# EAGLE design boost_converter (EAGLE 9.6.2)
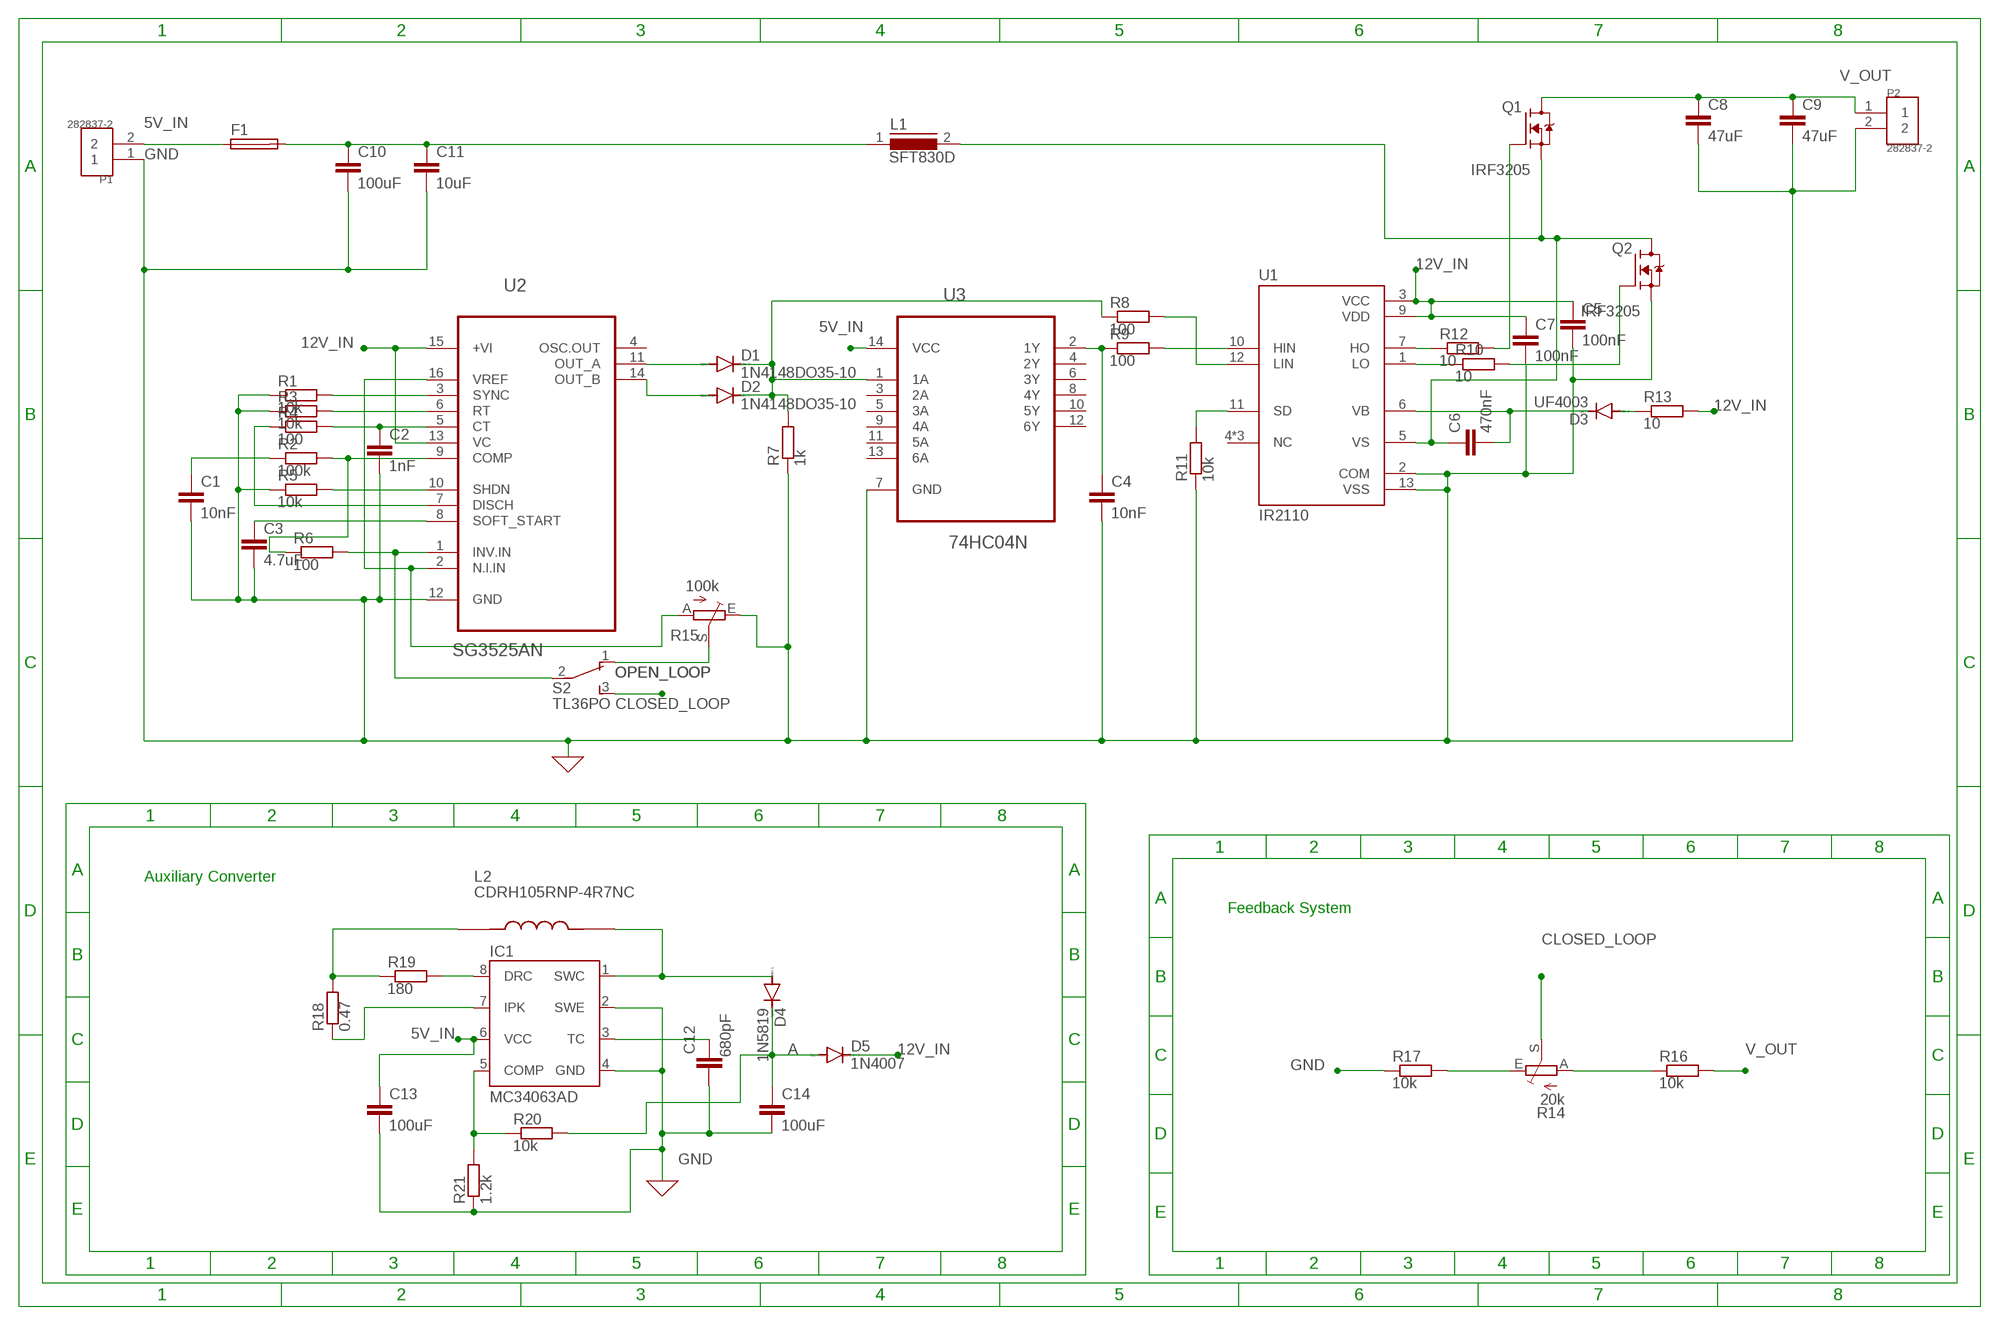
[diagram p0: schematic, sheet 1]

## Parts
C1  10nF  C2,5-3  [C2.5-3]
C2  1nF  C2,5-3  [C2.5-3]
C3  4.7uF  C2.5/5  [C2.5-5]
C4  10nF  C2,5-3  [C2.5-3]
C5  100nF  C2,5-3  [C2.5-3]
C6  470nF  C2,5-3  [C2.5-3]
C7  100nF  C2,5-3  [C2.5-3]
C8  47uF  C2.5/5  [C2.5-5]
C9  47uF  C2.5/5  [C2.5-5]
C10  100uF  C2.5/5  [C2.5-5]
C11  10uF  C2.5/5  [C2.5-5]
C12  680pF  C2,5-3  [C2.5-3]
C13  100uF  C2.5/5  [C2.5-5]
C14  100uF  C2.5/5  [C2.5-5]
D1  1N4148DO35-10  [DO35-10]
D2  1N4148DO35-10  [DO35-10]
D3  UF4003  [DO41-10]
D4  1N5819  1N4933  [DO41-10]
D5  1N4007  1N4004  [DO41-10]
F1  GSH15  [GSH15]
IC1  MC34063AD  [SO08]
L1  SFT830D  [SFT830D]
L2  CDRH105RNP-4R7NC  [IND_CDRH105RNP-4R7NC]
P1  282837-2  [TE_282837-2]
P2  282837-2  [TE_282837-2]
Q1  IRF3205  [TO254P1041X444X2933-3]
Q2  IRF3205  [TO254P1041X444X2933-3]
R1  10k  R-EU_0207/10  [0207/10]
R2  100k  R-EU_0207/10  [0207/10]
R3  10k  R-EU_0207/10  [0207/10]
R4  100  R-EU_0207/10  [0207/10]
R5  10k  R-EU_0207/10  [0207/10]
R6  100  R-EU_0207/10  [0207/10]
R7  1k  R-EU_0207/10  [0207/10]
R8  100  R-EU_0207/10  [0207/10]
R9  100  R-EU_0207/10  [0207/10]
R10  10  R-EU_0207/10  [0207/10]
R11  10k  R-EU_0207/10  [0207/10]
R12  10  R-EU_0207/10  [0207/10]
R13  10  R-EU_0207/10  [0207/10]
R14  20k  TRIM_EU-S64W  [S64W]
R15  100k  TRIM_EU-S64W  [S64W]
R16  10k  R-EU_0309/10  [0309/10]
R17  10k  R-EU_0309/10  [0309/10]
R18  0.47  R-EU_0207/10  [0207/10]
R19  180  R-EU_0207/10  [0207/10]
R20  10k  R-EU_0207/10  [0207/10]
R21  1.2k  R-EU_0207/10  [0207/10]
S2  TL36PO  [TL3XPO]
U1  IR2110  [DIP762W45P254L2019H533Q14]
U2  SG3525AN  [DIP254P762X510-16]
U3  74HC04N  [DIP254P762X420-14]

## Nets
5V_IN: C10.1 C11.1 C13.1 F1.1 F1.2 IC1.6(VCC) L1.1 P1.2 U3.14(VCC)
12V_IN: C5.1 C7.1 D5.C R13.2 U1.3(VCC) U1.9(VDD) U2.13(VC) U2.15(+VI)
A: C14.1 D4.C D5.A R20.2
CLOSED_LOOP: R14.S S2.3(S)
GND: C1.2 C2.2 C3.2 C4.2 C5.2 C7.2 C8.2 C9.2 C10.2 C11.2 C12.1 C13.2 C14.2 IC1.2(SWE) IC1.4(GND) P1.1 P2.2 Q2.3(S) R1.1 R3.1 R5.1 R7.1 R11.1 R15.E R17.1 R21.1 U1.2(COM) U1.13(VSS) U2.12(GND) U3.7(GND)
N$1: R15.A U2.2(N.I.IN) U2.16(VREF)
N$2: R2.2 R6.1 U2.9(COMP)
N$3: C1.1 R2.1
N$4: R3.2 U2.6(RT)
N$5: R1.2 U2.3(SYNC)
N$6: C2.1 R4.2 U2.5(CT)
N$7: R4.1 U2.7(DISCH)
N$8: D3.A R13.1
N$9: R5.2 U2.10(SHDN)
N$10: C3.1 U2.8(SOFT_START)
N$11: R6.2 S2.2(P) U2.1(INV.IN)
N$12: D2.A U2.14(OUT_B)
N$13: D1.A U2.11(OUT_A)
N$14: D1.C D2.C R7.2 R8.1 U3.1(1A)
N$15: R8.2 U1.12(LIN)
N$16: C4.1 R9.1 U3.2(1Y)
N$17: R9.2 U1.10(HIN)
N$18: R10.1 U1.1(LO)
N$19: IC1.8(DRC) R19.2
N$20: L2.1 R18.2 R19.1
N$21: C6.1 L1.2 Q1.3(S) Q2.2(D) U1.5(VS)
N$22: C6.2 D3.C U1.6(VB)
N$23: R11.2 U1.11(SD)
N$24: R12.1 U1.7(HO)
N$25: Q2.1(G) R10.2
N$26: Q1.1(G) R12.2
N$27: R14.A R16.1
N$28: R14.E R17.2
N$29: IC1.7(IPK) R18.1
N$30: IC1.5(COMP) R20.1 R21.2
N$34: C12.2 IC1.3(TC)
N$37: D4.A IC1.1(SWC) L2.2
OPEN_LOOP: R15.S S2.1(O)
V_OUT: C8.1 C9.1 P2.1 Q1.2(D) R16.2
Unconnected: U1.4(NC) U1.8(NC) U1.14(NC) U2.4(OSC.OUT) U3.3(2A) U3.4(2Y) U3.5(3A) U3.6(3Y) U3.8(4Y) U3.9(4A) U3.10(5Y) U3.11(5A) U3.12(6Y) U3.13(6A)

## Notes on the sheet
- Auxiliary Converter
- Feedback System

## Library data of the parts
C1-C14 = capacitor-wima:C: CAPACITOR naming: grid - package width
D1 D2 = diode:1N4148: DIODE high speed (Philips)
D3 = diode:UF4003: DIODE ultrafast recovery diode, 200 V rectifier
D4 = diode:1N4933: DIODE fast recovery rectifier, 1A
D5 = diode:1N4004: DIODE general purpose rectifier, 1 A
F1 = fuse:GSH15: FUSE HOLDER grid 15mm, 19649 Wickmann; MPN: 64900001039; OC_FARNELL: 1271673; OC_NEWARK: 02P0318
IC1 = MC34063A:MC34063A: Check availability <https://pricing.snapeda.com/parts/MC34063A/Texas%20Instruments/view-part?ref=eda>; AVAILABILITY: Not in stock; CHECK_PRICES: https://www.snapeda.com/parts/MC34063A/Texas+Instruments/view-part/?ref=eda; DESCRIPTION: Buck, Boost Switching Regulator IC Positive or Negative Adjustable 1.25V 1 Output 1.5A (Switch) 8-SOIC (0.154, 3.90mm Width); MF: Texas Instruments; MP: MC34063A; PACKAGE: SOIC-8 Texas Instruments; PRICE: None; SNAPEDA_LINK: https://www.snapeda.com/parts/MC34063A/Texas+Instruments/view-part/?ref=snap
L1 = inductors:SFT830D: INDUCTOR; SPICEPREFIX: L
L2 = CDRH105RNP-4R7NC:CDRH105RNP-4R7NC: Check availability <https://pricing.snapeda.com/parts/CDRH105RNP-4R7NC/Sumida/view-part?ref=eda>; AVAILABILITY: In Stock; CHECK_PRICES: https://www.snapeda.com/parts/CDRH105RNP-4R7NC/Sumida/view-part/?ref=eda; DESCRIPTION: 4.7 µH Shielded - Inductor 6.1 A 12.3mOhm Max Nonstandard; MF: Sumida; MP: CDRH105RNP-4R7NC; PACKAGE: Nonstandard Sumida; PRICE: None; SNAPEDA_LINK: https://www.snapeda.com/parts/CDRH105RNP-4R7NC/Sumida/view-part/?ref=snap
P1 P2 = 282837-2:282837-2: Check availability <https://pricing.snapeda.com/parts/282837-2/TE%20Connectivity/view-part?ref=eda>; AVAILABILITY: In Stock; CHECK_PRICES: https://www.snapeda.com/parts/282837-2/TE+Connectivity+AMP+Connectors/view-part/?ref=eda; COMMENT: 282837-2; DESCRIPTION: Terminal Block Connector Wire Receptacle 2 5.08 mm 30-16 AWG Green 13.5 A 250 V | TE Connectivity 282837-2; MF: TE Connectivity; MP: 282837-2; PACKAGE: None; PRICE: None; SNAPEDA_LINK: https://www.snapeda.com/parts/282837-2/TE+Connectivity+AMP+Connectors/view-part/?ref=snap
Q1 Q2 = IRF3205:IRF3205: Check availability <https://pricing.snapeda.com/parts/IRF3205/Infineon%20Technologies/view-part?ref=eda>; AVAILABILITY: In Stock; CHECK_PRICES: https://www.snapeda.com/parts/IRF3205/Infineon/view-part/?ref=eda; DESCRIPTION: N-Channel 55V 110A (Tc) 200W (Tc) Through Hole TO-220AB; MF: Infineon Technologies; MP: IRF3205; PACKAGE: TO-220 Infineon; PRICE: None; SNAPEDA_LINK: https://www.snapeda.com/parts/IRF3205/Infineon/view-part/?ref=snap
R1-R13 R16-R21 = rcl:R-EU_: RESISTOR, European symbol; SPICEPREFIX: R
R14 R15 = pot:TRIM_EU-: POTENTIOMETER
S2 = switch:TL36PO: TINY SWITCH ON - ON Source: http://www2.produktinfo.conrad.com/datenblaetter/700000-724999/705152-da-01-de-Subminiaturschalter_TL_36YO.pdf
U1 = IR2110:IR2110: Check availability <https://pricing.snapeda.com/parts/IR2110/Infineon/view-part?ref=eda>; AVAILABILITY: In Stock; CHECK_PRICES: https://www.snapeda.com/parts/IR2110/Infineon/view-part/?ref=eda; DESCRIPTION: Half-Bridge Gate Driver IC Non-Inverting 14-PDIP; MF: Infineon; MP: IR2110; PACKAGE: DIP-14 International Rectifier; PRICE: None; SNAPEDA_LINK: https://www.snapeda.com/parts/IR2110/Infineon/view-part/?ref=snap
U2 = SG3525AN:SG3525AN: Check availability <https://pricing.snapeda.com/parts/SG3525AN/STMicroelectronics/view-part?ref=eda>; AVAILABILITY: In Stock; CHECK_PRICES: https://www.snapeda.com/parts/SG3525AN/STMicroelectronics/view-part/?ref=eda; DESCRIPTION: Buck, Push-Pull Regulator Positive Output Step-Down, Step-Up/Step-Down - DC-DC Controller IC 16-DIP; MF: STMicroelectronics; MP: SG3525AN; PACKAGE: PDIP-16 ON Semiconductor; PRICE: None; SNAPEDA_LINK: https://www.snapeda.com/parts/SG3525AN/STMicroelectronics/view-part/?ref=snap
U3 = 74HC04N:74HC04N: Check availability <https://pricing.snapeda.com/parts/74HC04N/Texas%20Instruments/view-part?ref=eda>; AVAILABILITY: In Stock; CHECK_PRICES: https://www.snapeda.com/parts/74HC04N/Texas+Instruments/view-part/?ref=eda; DESCRIPTION: Inverter IC 6 Channel - 14-PDIP; MF: Texas Instruments; MP: 74HC04N; PACKAGE: DIP-14 NXP Semiconductors; PRICE: None; SNAPEDA_LINK: https://www.snapeda.com/parts/74HC04N/Texas+Instruments/view-part/?ref=snap

## Board
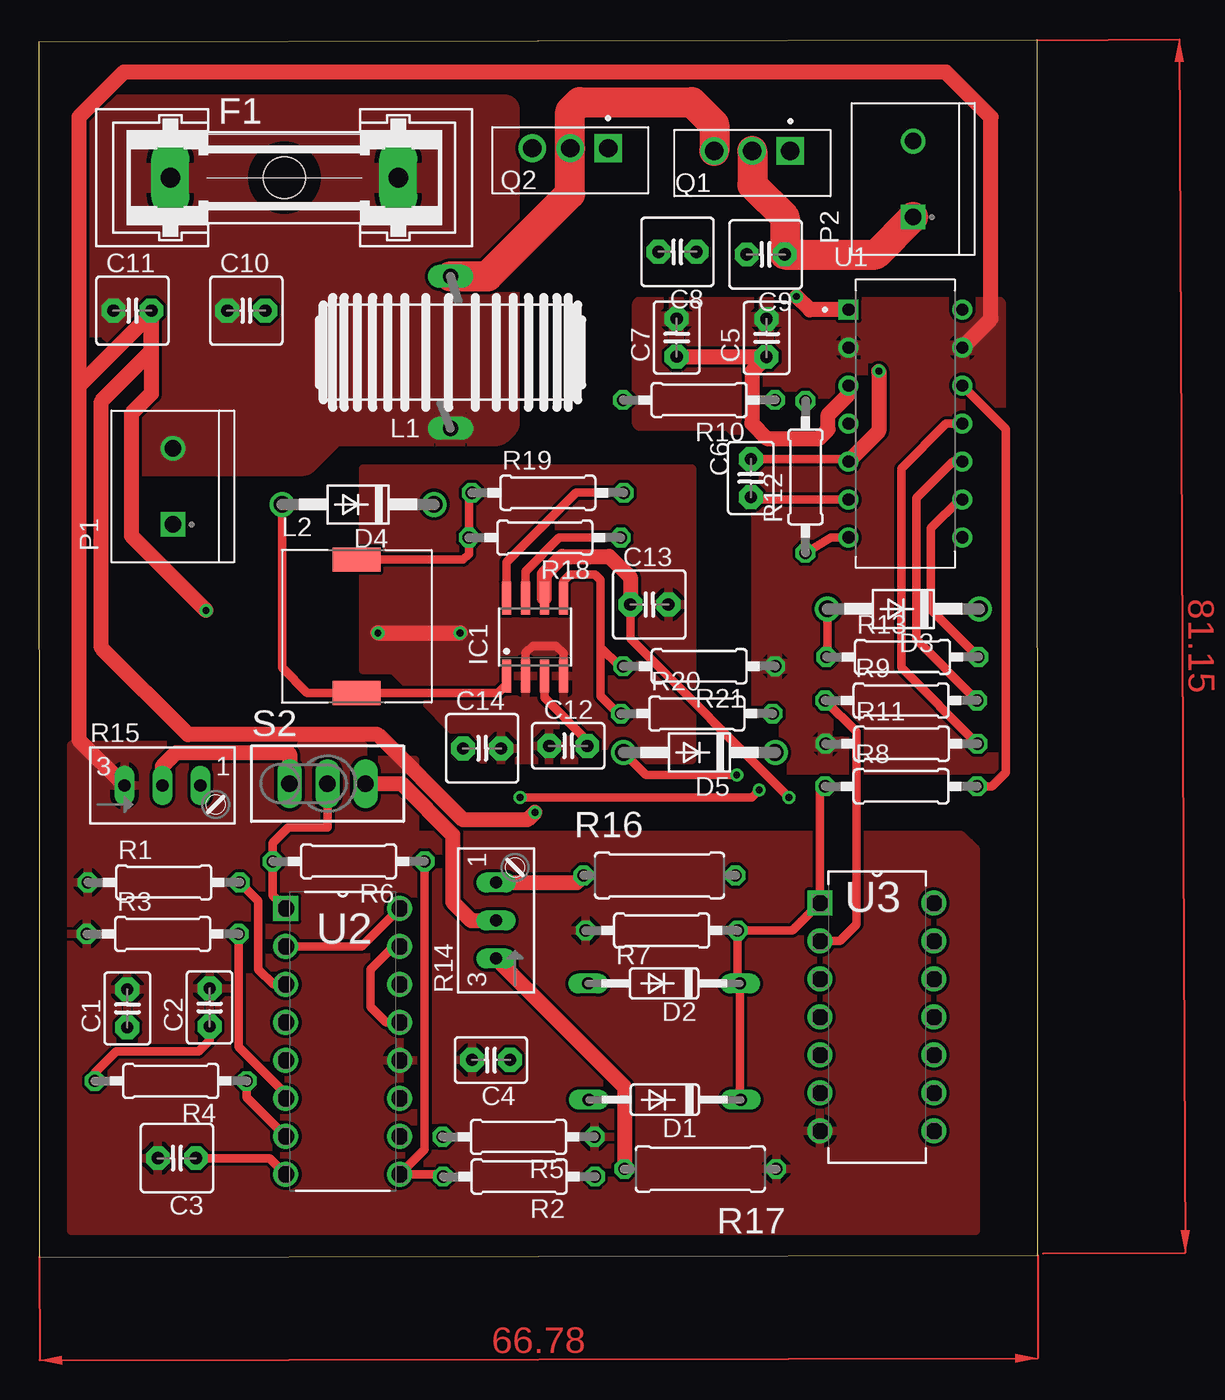
[diagram p1: board, top side]
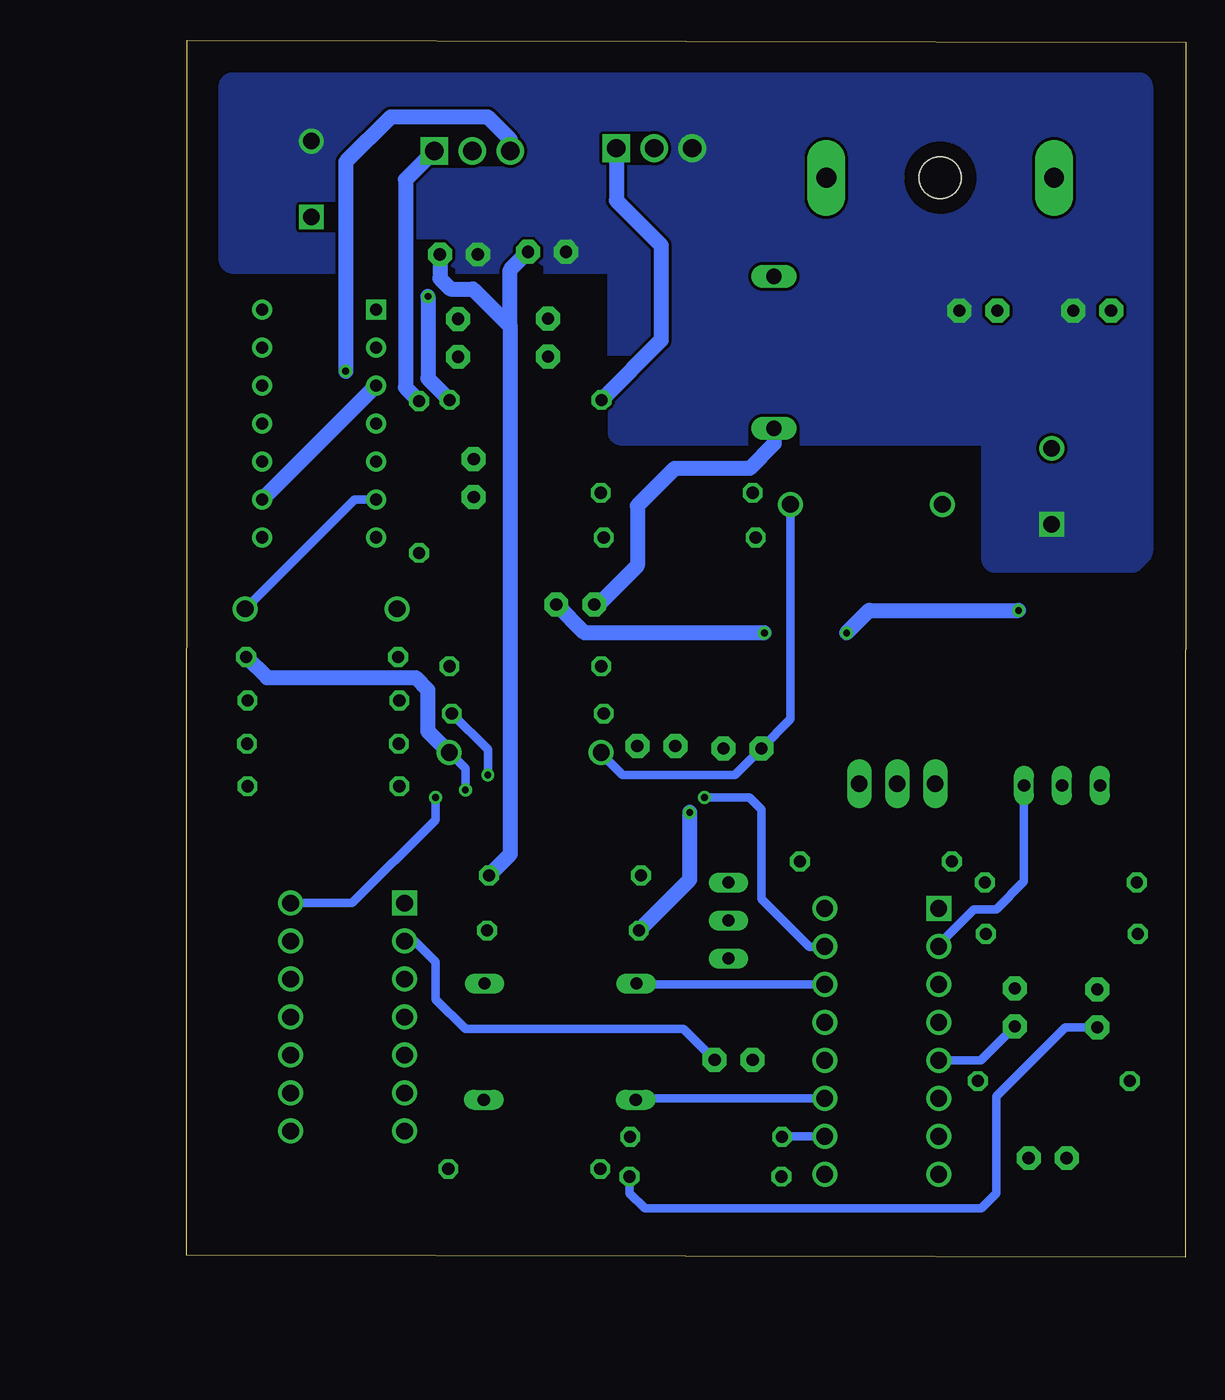
[diagram p2: board, bottom side, seen from below]

Size 66.8 x 81.41 mm. Coordinates in mm from the lower left corner, seen from the top.
Outline: 0.03,0 66.8,0.14 66.78,81.41 0,81.27 0.03,0
Copper layers (1*16): Top 0.035mm / dielectric 1.5mm / Bottom 0.035mm
Design rules "default": minimum track width 22mil, minimum drill 18mil, track to track 8mil, track to pad 8mil, pad to pad 8mil, via to via 8mil, smd to smd 8mil, copper to edge 40mil, drill to drill 8mil, minimum pad ring 10mil, minimum via ring 8mil, stop-mask expansion 4mil, vias tented up to drill 0mil, thermal gap 12mil

### Footprints (pad centres in the part's own frame; a part is rotated, then mirrored left to right if it is on the bottom)
C2.5-3 = drill 0.813 pad 1.6 octagon: 1 -1.27,0; 2 1.27,0
C2.5-5 = drill 0.813 pad 1.6 octagon: 1 -1.27,0; 2 1.27,0
DO35-10 = drill 0.813 long: A 5.08,0; C -5.08,0
DO41-10 = drill 1.118: A 5.08,0; C -5.08,0
GSH15 = drill 1.321 pad 2.54 long: 1 -7.62,0; 2 7.62,0 | hole 2.794: 0,0
SO08 = smd 0.6 x 2.2: 1 -1.905,-2.6; 2 -0.635,-2.6; 3 0.635,-2.6; 4 1.905,-2.6; 5 1.905,2.6; 6 0.635,2.6; 7 -0.635,2.6; 8 -1.905,2.6
SFT830D = drill 1.016 long: 1 -5.08,0; 2 5.08,0
IND_CDRH105RNP-4R7NC = smd 3.2 x 1.6: 1 0,4.45; 2 0,-4.45
TE_282837-2 = drill 1.1 square: 1 -2.54,0 | drill 1.1: 2 2.54,0
TO254P1041X444X2933-3 = drill 1.23 pad 1.85 square: 1 0,0 | drill 1.23 pad 1.85: 2 2.54,0; 3 5.08,0
0207/10 = drill 0.813 octagon: 1 -5.08,0; 2 5.08,0
S64W = drill 0.813 long: A 2.54,1.27; E -2.54,1.27; S 0,1.27
0309/10 = drill 0.813 octagon: 1 -5.08,0; 2 5.08,0
TL3XPO = drill 1.1 pad 1.422 long: 1 -2.54,0; 2 0,0; 3 2.54,0
DIP762W45P254L2019H533Q14 = drill 0.83 pad 1.25 square: 1 -3.81,7.62 | drill 0.83 pad 1.25: 2 -3.81,5.08; 3 -3.81,2.54; 4 -3.81,0; 5 -3.81,-2.54; 6 -3.81,-5.08; 7 -3.81,-7.62; 8 3.81,-7.62; 9 3.81,-5.08; 10 3.81,-2.54; 11 3.81,0; 12 3.81,2.54; 13 3.81,5.08; 14 3.81,7.62
DIP254P762X510-16 = drill 1.118 square: 1 -7.62,17.78 | drill 1.118: 2 -7.62,15.24; 3 -7.62,12.7; 4 -7.62,10.16; 5 -7.62,7.62; 6 -7.62,5.08; 7 -7.62,2.54; 8 -7.62,0; 9 0,0; 10 0,2.54; 11 0,5.08; 12 0,7.62; 13 0,10.16; 14 0,12.7; 15 0,15.24; 16 0,17.78
DIP254P762X420-14 = drill 1.118 square: 1 -7.62,15.24 | drill 1.118: 2 -7.62,12.7; 3 -7.62,10.16; 4 -7.62,7.62; 5 -7.62,5.08; 6 -7.62,2.54; 7 -7.62,0; 8 0,0; 9 0,2.54; 10 0,5.08; 11 0,7.62; 12 0,10.16; 13 0,12.7; 14 0,15.24

### Placement (x,y rotation side)
C1  5.91,16.64 90 top
C2  11.41,16.71 90 top
C3  9.23,6.63 180 top
C4  30.23,13.19 180 top
C5  48.67,61.49 90 top
C6  47.61,52.12 270 top
C7  42.66,61.51 90 top
C8  42.7,67.24 180 top
C9  48.61,67.07 180 top
C10  13.87,63.31 0 top
C11  6.25,63.31 0 top
C12  35.4,34.2 0 top
C13  40.82,43.65 0 top
C14  29.65,34.04 0 top
D1  41.86,10.54 180 top
D2  41.82,18.32 180 top
D3  57.82,43.37 180 top
D4  21.35,50.36 180 top
D5  44.17,33.76 180 top
F1  16.41,72.2 0 top
IC1  33.17,41.49 0 top
L1  27.53,60.52 90 top
L2  21.25,42.2 0 top
P1  8.95,51.55 90 top
P2  58.47,72.11 90 top
Q1  50.25,73.99 180 top
Q2  38.07,74.17 180 top
R1  8.35,25.07 0 top
R2  32.11,5.39 180 top
R3  8.28,21.62 0 top
R4  8.82,11.79 180 top
R5  32.07,8.06 180 top
R6  20.71,26.48 180 top
R7  41.65,21.85 0 top
R8  57.67,31.5 0 top
R9  57.67,37.24 0 top
R10  44.15,57.34 180 top
R11  57.7,34.35 0 top
R12  51.27,52.19 90 top
R13  57.76,40.15 0 top
R14  31.85,22.52 90 top
R15  8.26,30.29 0 top
R16  41.51,25.54 0 top
R17  44.23,5.91 180 top
R18  33.84,48.13 180 top
R19  34.04,51.13 0 top
R20  44,36.36 0 top
R21  44.16,39.53 180 top
S2  19.29,31.68 0 top
U1  57.95,55.76 0 top
U2  24.13,5.55 0 top
U3  59.87,8.45 0 top

### Tracks (layer width: path | path; a pad name or v marks a point on that pad's centre or on a via)
5V_IN  (via drill 0.46)
  Top 0.559: C13.1 39.55,41.38 v50.17,30.76
  Top 1: IC1.6 33.81,45.69 34.99,46.88 38.15,46.88 39.55,45.48 C13.1
  Bottom 0.559: v50.17,30.76 50.17,29.26 55.75,23.69 U3.14
  Bottom 1: L1.1 27.53,54.4 29.17,52.76 34.17,52.76 36.67,50.26 36.67,46.26 39.28,43.65 C13.1
  pour Top: 3.67,76.76 3.67,53.26 17.67,53.26 19.67,55.26 30.67,55.26 31.17,55.76 31.17,76.76
12V_IN  (via drill 0.46)
  Top 0.559: U2.15 24.11,20.76 23.67,20.76 22.17,19.26 22.17,16.76 23.23,15.71 U2.13 | R13.2 59.67,43.32 59.67,48.76 61.59,50.68 U1.9 | v48.17,31.26 47.67,30.76 v32.17,30.76
  Top 1: C7.1 48.64,60.24 C5.1 47.67,59.22 47.67,55.76 48.67,54.76 52.17,54.76 52.77,55.36 52.77,56.33 54.14,57.7 U1.3
  Bottom 0.559: U2.15 24.16,20.76 25.17,20.76 28.38,23.96 28.38,29.96 29.17,30.76 v32.17,30.76 | D5.C 48.17,32.68 v48.17,31.26
  Bottom 1: R13.2 61.44,38.76 51.48,38.76 | U1.3 U1.9
  Bottom 1.016: 51.48,38.76 50.67,37.95 50.67,35.18 D5.C
A  (via drill 0.46)
  Top 0.559: D5.A 40.59,32.26 v46.67,32.26
  Bottom 0.559: D4.C 26.43,35.99 C14.1 30.15,32.26 37.67,32.26 39.09,33.68 D5.A | v46.67,32.26 46.67,33.95 R20.2
CLOSED_LOOP
  Top 1: S2.3 24.26,31.68 27.67,28.26 27.67,23.76 28.91,22.52 R14.S
GND  (via drill 0.46)
  Top 0.559: IC1.2 32.54,40.43 33,40.89 34.59,40.89 35.08,40.41 IC1.4
  Top 1: C11.2 7.52,63.11 2.67,58.26 | 2.67,58.26 2.67,34.61 R15.E | C11.2 7.52,60.61 4.17,57.26 4.17,40.76 9.97,34.96 22.67,34.96 28.37,29.26 32.67,29.26 v33.17,29.76 | C11.2 7.52,57.76 6.17,56.41 6.17,48.26 v11.17,43.26 | v22.67,41.76 v28.17,41.76 | U1.13 63.67,62.75 63.67,76.26 60.67,79.26 5.67,79.26 2.67,76.26 2.67,58.26
  Bottom 1: R7.1 33.17,25.25 v33.17,29.76 | v11.17,43.26 21.17,43.26 v22.67,41.76 | v28.17,41.76 40.2,41.76 C13.2
  pour Top: 2.17,34.26 21.67,34.26 21.67,33.26 25.17,33.26 25.17,28.26 61.67,28.26 62.67,27.26 62.67,1.76 2.17,1.76
  pour Bottom: 3.17,78.26 3.17,47.26 3.67,46.76 12.67,46.76 12.67,55.26 37.67,55.26 37.67,66.76 63.67,66.76 63.67,78.26
  pour Top: 40.17,63.76 64.17,63.76 64.17,32.76 48.17,32.76 48.17,53.76 46.17,55.76 40.17,55.76
  pour Top: 21.67,52.76 43.67,52.76 43.67,33.26 29.67,33.26 23.67,39.26 21.67,39.26
N$1
  Top 0.559: U2.16 21.59,20.79 U2.2
  Bottom 0.559: R15.A 10.8,25.13 12.67,23.26 14.17,23.26 16.51,20.92 U2.2
N$2
  Top 0.559: R6.1 25.79,7.21 U2.9 26.88,5.55 R2.2
N$3
  Bottom 0.559: C1.1 8.06,15.37 12.67,10.76 12.67,4.26 13.67,3.26 36.17,3.26 37.19,4.28 R2.1
N$4
  Top 0.559: R3.2 13.36,14.07 16.51,10.92 U2.6
N$5
  Top 0.559: R1.2 14.67,23.83 14.67,19.26 15.69,18.25 U2.3
N$6
  Top 0.559: R4.2 3.74,12.33 5.17,13.76 10.67,13.76 11.41,14.5 C2.1
  Bottom 0.559: C2.1 13.69,13.17 U2.5
N$7
  Top 0.559: R4.1 13.9,10.7 U2.7
N$8
  Top 0.559: D3.A 52.74,40.22 R13.1
N$9
  Bottom 0.559: U2.10 26.96,8.09 R5.2
N$10
  Top 0.559: C3.1 15.43,6.63 U2.8
N$11
  Top 0.559: U2.1 15.63,24.21 R6.2 15.63,27.72 16.67,28.76 19.29,28.76 S2.2
N$12
  Bottom 0.559: U2.14 36.67,18.25 D2.A
N$13
  Bottom 0.559: U2.11 36.69,10.63 D1.A
N$14
  Top 0.559: 46.9,10.58 D2.C 46.73,18.48 R7.2 50.41,21.85 U3.1 52.25,31.16 R8.1
  Top 1: 46.9,10.58 D1.C
N$15
  Top 0.559: R8.2 63.75,31.5 64.67,32.43 64.67,55.39 U1.12
N$16
  Top 0.559: U3.2 53.56,21.15 54.67,22.26 54.67,35.15 R9.1
  Bottom 0.559: C4.1 33.57,15.26 48.17,15.26 50.17,17.26 50.17,19.76 51.56,21.15 U3.2
N$17
  Top 0.559: R9.2 58.67,41.31 58.67,50.76 61.13,53.22 U1.10
N$18  (via drill 0.46)
  Top 1: U1.1 51.55,63.38 v50.67,64.26
  Bottom 1: v50.67,64.26 50.67,58.78 R10.1
N$19
  Top 0.559: IC1.8 31.27,46.5 35.92,51.15 39.1,51.15 R19.2
N$20
  Top 0.559: L2.1 28.38,46.65 28.76,47.03 R18.2 28.76,50.93 R19.1
N$21  (via drill 0.46)
  Top 0.559: C6.1 53.97,53.39 U1.5
  Top 1: v56.17,59.26 56.17,55.25 U1.5
  Top 2: L1.2 30.02,65.6 35.53,71.12 Q2.2 35.53,76.62 36.17,77.26 43.67,77.26 45.17,75.76 Q1.3
  Bottom 1: Q1.3 45.17,74.76 46.67,76.26 53.17,76.26 56.17,73.26 v56.17,59.26
N$22
  Top 0.559: C6.2 47.79,50.68 U1.6
  Bottom 0.559: U1.6 55.59,50.68 D3.C
N$23
  Top 0.559: R11.2 57.67,39.45 57.67,52.76 60.67,55.76 U1.11
N$24
  Top 0.559: U1.7 52.96,48.14 R12.1
N$25
  Bottom 1: Q2.1 38.07,70.67 35.07,67.67 35.07,61.34 R10.2
N$26
  Bottom 1: Q1.1 52.17,72.07 52.17,58.17 R12.2
N$27
  Top 1: R14.A 35.96,25.06 R16.1
N$28
  Top 1: R14.E 39.16,11.41 R17.2
N$29
  Top 0.559: IC1.7 32.54,45.87 34.8,48.13 R18.1
N$30
  Top 0.559: IC1.5 35.08,45.24 35.51,45.66 37.21,45.66 37.57,45.3 37.57,40.78 | 37.57,40.78 37.57,37.52 38.73,36.36 R20.1 | 37.57,40.78 38.82,39.53 R21.2
N$34
  Top 0.559: IC1.3 33.81,37.43 36.67,34.57 C12.2
N$37
  Top 0.559: IC1.1 31.27,38.3 30.72,37.75 L2.2 17.95,37.75 16.27,39.44 D4.A
OPEN_LOOP
  Top 1: R15.S 8.26,32.85 9.17,33.76 16.67,33.76 16.75,33.68 S2.1
V_OUT
  Top 2: Q1.2 47.71,71.72 49.88,69.55 C9.1 55.97,67.07 P2.1
  Bottom 1: C9.1 49.88,65.47 49.17,64.76 47.67,64.76 45.17,62.26 | C8.1 45.17,66.04 45.17,62.26 | 45.17,62.26 45.17,26.96 R16.2
(copper drawn outside any net)
  shapes: Top area x2